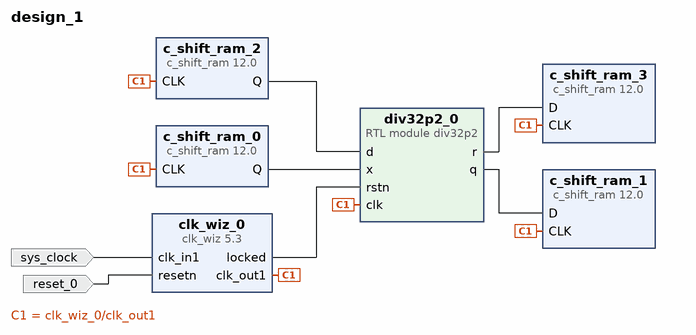
[diagram p0: block diagram of the top level]
# Vivado block design design_1, xc7a35ticsg324-1L, Vivado 2016.4
create_bd_design design_1

create_bd_port -dir I -type clk sys_clock
set_property -dict {CONFIG.FREQ_HZ 100000000 CONFIG.PHASE 0.000} [get_bd_ports sys_clock]
create_bd_port -dir I -type rst reset_0
set_property -dict {CONFIG.POLARITY ACTIVE_LOW} [get_bd_ports reset_0]

create_bd_cell -type ip -vlnv xilinx.com:ip:clk_wiz:5.3 clk_wiz_0
set_property -dict [list \
  CONFIG.RESET_PORT resetn \
  CONFIG.RESET_TYPE ACTIVE_LOW \
  CONFIG.USE_BOARD_FLOW true \
  CONFIG.CLK_IN1_BOARD_INTERFACE sys_clock \
  CONFIG.RESET_BOARD_INTERFACE reset \
] [get_bd_cells clk_wiz_0]
create_bd_cell -type ip -vlnv xilinx.com:ip:c_shift_ram:12.0 c_shift_ram_0
set_property -dict [list \
  CONFIG.Width 64 \
  CONFIG.DefaultData 0000000000000000000000000000000000000000000000000000000000000000 \
  CONFIG.AsyncInitVal 0000000000000000000000000000000000000000000000000000000000000000 \
] [get_bd_cells c_shift_ram_0]
create_bd_cell -type ip -vlnv xilinx.com:ip:c_shift_ram:12.0 c_shift_ram_1
set_property -dict [list \
  CONFIG.Width 32 \
  CONFIG.DefaultData 00000000000000000000000000000000 \
  CONFIG.AsyncInitVal 00000000000000000000000000000000 \
] [get_bd_cells c_shift_ram_1]
create_bd_cell -type ip -vlnv xilinx.com:ip:c_shift_ram:12.0 c_shift_ram_2
set_property -dict [list \
  CONFIG.Width 32 \
  CONFIG.DefaultData 00000000000000000000000000000000 \
  CONFIG.AsyncInitVal 00000000000000000000000000000000 \
] [get_bd_cells c_shift_ram_2]
create_bd_cell -type ip -vlnv xilinx.com:ip:c_shift_ram:12.0 c_shift_ram_3
set_property -dict [list \
  CONFIG.Width 32 \
  CONFIG.DefaultData 00000000000000000000000000000000 \
  CONFIG.AsyncInitVal 00000000000000000000000000000000 \
] [get_bd_cells c_shift_ram_3]
create_bd_cell -type module -reference div32p2 div32p2_0

# ---- connections ----

connect_bd_net [get_bd_ports sys_clock] [get_bd_pins clk_wiz_0/clk_in1]
connect_bd_net [get_bd_pins clk_wiz_0/clk_out1] \
  [get_bd_pins c_shift_ram_2/CLK] [get_bd_pins c_shift_ram_0/CLK] [get_bd_pins c_shift_ram_1/CLK] \
  [get_bd_pins c_shift_ram_3/CLK] [get_bd_pins div32p2_0/clk]
connect_bd_net [get_bd_pins c_shift_ram_2/Q] [get_bd_pins div32p2_0/d]
connect_bd_net [get_bd_pins c_shift_ram_0/Q] [get_bd_pins div32p2_0/x]
connect_bd_net [get_bd_pins div32p2_0/r] [get_bd_pins c_shift_ram_3/D]
connect_bd_net [get_bd_pins div32p2_0/q] [get_bd_pins c_shift_ram_1/D]
connect_bd_net -net reset_0_1 [get_bd_ports reset_0] [get_bd_pins clk_wiz_0/resetn]
connect_bd_net [get_bd_pins clk_wiz_0/locked] [get_bd_pins div32p2_0/rstn]

validate_bd_design
save_bd_design
